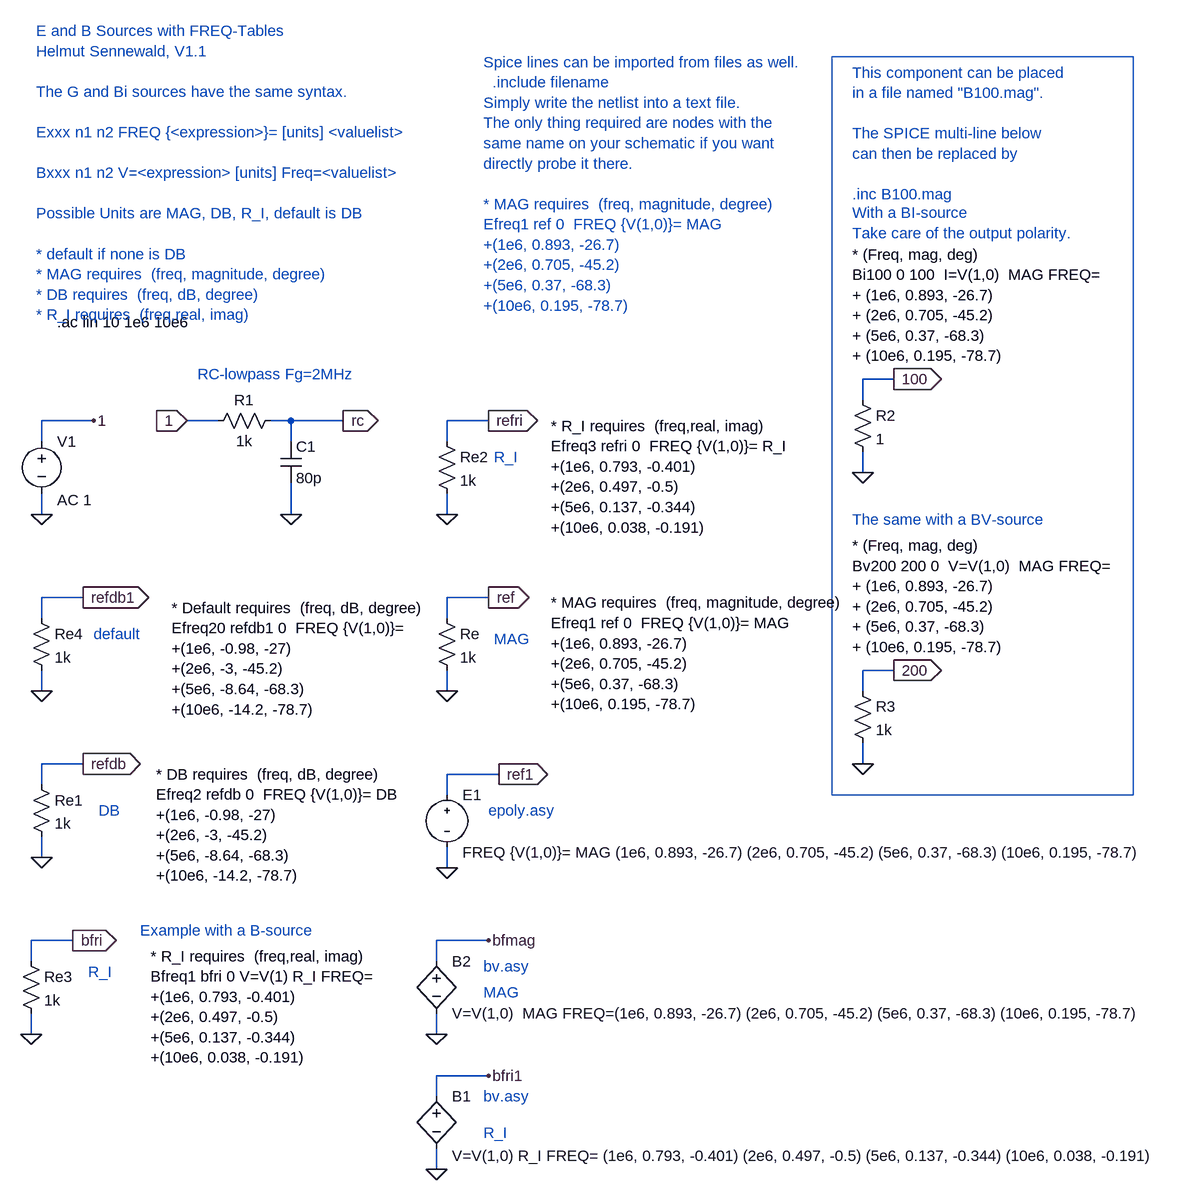
[diagram p0: schematic freq_table_E_B_1.asc]
freq_table_E_B_1.asc, the LTspice schematic file:
Version 4
SHEET 1 2784 1556
WIRE -80 800 -80 768
WIRE -80 912 -80 880
WIRE -64 0 -64 -32
WIRE -64 112 -64 80
WIRE -64 272 -64 240
WIRE -64 384 -64 352
WIRE -64 528 -64 496
WIRE -64 640 -64 608
WIRE -16 768 -80 768
WIRE 0 240 -64 240
WIRE 0 496 -64 496
WIRE 16 -32 -64 -32
WIRE 208 -32 160 -32
WIRE 320 -32 288 -32
WIRE 320 0 320 -32
WIRE 320 112 320 64
WIRE 400 -32 320 -32
WIRE 544 800 544 768
WIRE 544 912 544 880
WIRE 544 1008 544 976
WIRE 544 1120 544 1088
WIRE 560 0 560 -32
WIRE 560 112 560 80
WIRE 560 272 560 240
WIRE 560 384 560 352
WIRE 560 544 560 512
WIRE 560 656 560 624
WIRE 624 -32 560 -32
WIRE 624 240 560 240
WIRE 624 768 544 768
WIRE 624 976 544 976
WIRE 640 512 560 512
WIRE 1200 -64 1200 -96
WIRE 1200 48 1200 16
WIRE 1200 384 1200 352
WIRE 1200 496 1200 464
WIRE 1248 -96 1200 -96
WIRE 1248 352 1200 352
FLAG -64 112 0
FLAG 16 -32 1
FLAG 560 384 0
FLAG 624 240 ref
IOPIN 624 240 Out
FLAG 160 -32 1
IOPIN 160 -32 In
FLAG 320 112 0
FLAG 400 -32 rc
IOPIN 400 -32 Out
FLAG -64 640 0
FLAG 0 496 refdb
IOPIN 0 496 Out
FLAG 560 112 0
FLAG 624 -32 refri
IOPIN 624 -32 Out
FLAG -80 912 0
FLAG -16 768 bfri
IOPIN -16 768 Out
FLAG -64 384 0
FLAG 0 240 refdb1
IOPIN 0 240 Out
FLAG 544 1120 0
FLAG 624 976 bfri1
FLAG 560 656 0
FLAG 640 512 ref1
IOPIN 640 512 Out
FLAG 544 912 0
FLAG 624 768 bfmag
FLAG 1200 48 0
FLAG 1248 -96 100
IOPIN 1248 -96 Out
FLAG 1200 496 0
FLAG 1248 352 200
IOPIN 1248 352 Out
SYMBOL voltage -64 -16 R0
WINDOW 123 24 106 Left 0
WINDOW 39 0 0 Left 0
SYMATTR Value2 AC 1
SYMATTR InstName V1
SYMATTR Value ""
SYMBOL res 544 256 R0
SYMATTR InstName Re
SYMATTR Value 1k
SYMBOL res 192 -16 R270
WINDOW 0 32 56 VTop 0
WINDOW 3 0 56 VBottom 0
SYMATTR InstName R1
SYMATTR Value 1k
SYMBOL cap 304 0 R0
SYMATTR InstName C1
SYMATTR Value 80p
SYMBOL res -80 512 R0
SYMATTR InstName Re1
SYMATTR Value 1k
SYMBOL res 544 -16 R0
SYMATTR InstName Re2
SYMATTR Value 1k
SYMBOL res -96 784 R0
SYMATTR InstName Re3
SYMATTR Value 1k
SYMBOL res -80 256 R0
SYMATTR InstName Re4
SYMATTR Value 1k
SYMBOL bv 544 992 R0
WINDOW 3 24 107 Left 0
SYMATTR InstName B1
SYMATTR Value V=V(1,0) R_I FREQ= (1e6, 0.793, -0.401) (2e6, 0.497, -0.5) (5e6, 0.137, -0.344) (10e6, 0.038, -0.191)
SYMBOL Misc\\Epoly 560 528 R0
SYMATTR InstName E1
SYMATTR Value FREQ {V(1,0)}= MAG (1e6, 0.893, -26.7) (2e6, 0.705, -45.2) (5e6, 0.37, -68.3) (10e6, 0.195, -78.7)
SYMBOL bv 544 784 R0
SYMATTR InstName B2
SYMATTR Value V=V(1,0)  MAG FREQ=(1e6, 0.893, -26.7) (2e6, 0.705, -45.2) (5e6, 0.37, -68.3) (10e6, 0.195, -78.7)
SYMBOL res 1184 -80 R0
SYMATTR InstName R2
SYMATTR Value 1
SYMBOL res 1184 368 R0
SYMATTR InstName R3
SYMATTR Value 1k
TEXT 720 248 Left 0 !* MAG requires  (freq, magnitude, degree)\nEfreq1 ref 0  FREQ {V(1,0)}= MAG\n+(1e6, 0.893, -26.7)\n+(2e6, 0.705, -45.2)  \n+(5e6, 0.37, -68.3)\n+(10e6, 0.195, -78.7)
TEXT -40 -184 Left 0 !.ac lin 10 1e6 10e6
TEXT 616 -584 Left 0 ;Spice lines can be imported from files as well.\n  .include filename\nSimply write the netlist into a text file.\nThe only thing required are nodes with the\nsame name on your schematic if you want\ndirectly probe it there.\n \n* MAG requires  (freq, magnitude, degree)\nEfreq1 ref 0  FREQ {V(1,0)}= MAG\n+(1e6, 0.893, -26.7)\n+(2e6, 0.705, -45.2)  \n+(5e6, 0.37, -68.3)\n+(10e6, 0.195, -78.7)
TEXT 112 512 Left 0 !* DB requires  (freq, dB, degree)\nEfreq2 refdb 0  FREQ {V(1,0)}= DB\n+(1e6, -0.98, -27)\n+(2e6, -3, -45.2)  \n+(5e6, -8.64, -68.3)\n+(10e6, -14.2, -78.7)
TEXT -72 -632 Left 0 ;E and B Sources with FREQ-Tables\nHelmut Sennewald, V1.1\n \nThe G and Bi sources have the same syntax.\n \nExxx n1 n2 FREQ {<expression>}= [units] <valuelist> \n \nBxxx n1 n2 V=<expression> [units] Freq=<valuelist>\n \nPossible Units are MAG, DB, R_I, default is DB\n \n* default if none is DB \n* MAG requires  (freq, magnitude, degree)\n* DB requires  (freq, dB, degree)\n* R_I requires  (freq,real, imag)
TEXT 720 -24 Left 0 !* R_I requires  (freq,real, imag)\nEfreq3 refri 0  FREQ {V(1,0)}= R_I\n+(1e6, 0.793, -0.401)\n+(2e6, 0.497, -0.5)  \n+(5e6, 0.137, -0.344)\n+(10e6, 0.038, -0.191)
TEXT 104 792 Left 0 !* R_I requires  (freq,real, imag)\nBfreq1 bfri 0 V=V(1) R_I FREQ=\n+(1e6, 0.793, -0.401)\n+(2e6, 0.497, -0.5)  \n+(5e6, 0.137, -0.344)\n+(10e6, 0.038, -0.191)
TEXT 136 256 Left 0 !* Default requires  (freq, dB, degree)\nEfreq20 refdb1 0  FREQ {V(1,0)}=  \n+(1e6, -0.98, -27)\n+(2e6, -3, -45.2)  \n+(5e6, -8.64, -68.3)\n+(10e6, -14.2, -78.7)
TEXT 88 752 Left 0 ;Example with a B-source
TEXT 632 304 Left 0 ;MAG
TEXT 632 24 Left 0 ;R_I
TEXT 24 568 Left 0 ;DB
TEXT 16 296 Left 0 ;default
TEXT 8 816 Left 0 ;R_I
TEXT 624 568 Left 0 ;epoly.asy
TEXT 616 1008 Left 0 ;bv.asy
TEXT 176 -104 Left 0 ;RC-lowpass Fg=2MHz
TEXT 616 808 Left 0 ;bv.asy
TEXT 1184 -288 Left 0 !* (Freq, mag, deg)\nBi100 0 100  I=V(1,0)  MAG FREQ=\n+ (1e6, 0.893, -26.7)\n+ (2e6, 0.705, -45.2)\n+ (5e6, 0.37, -68.3)\n+ (10e6, 0.195, -78.7)
TEXT 616 848 Left 0 ;MAG
TEXT 616 1064 Left 0 ;R_I
TEXT 1184 -568 Left 0 ;This component can be placed\nin a file named "B100.mag".\n \nThe SPICE multi-line below \ncan then be replaced by\n \n.inc B100.mag
TEXT 1184 160 Left 0 !* (Freq, mag, deg)\nBv200 200 0  V=V(1,0)  MAG FREQ=\n+ (1e6, 0.893, -26.7)\n+ (2e6, 0.705, -45.2)\n+ (5e6, 0.37, -68.3)\n+ (10e6, 0.195, -78.7)
TEXT 1184 120 Left 0 ;The same with a BV-source
TEXT 1184 -352 Left 0 ;With a BI-source\nTake care of the output polarity.
RECTANGLE Normal 1616 544 1152 -592

The netlist it stands for:
* freq_table_E_B_1.asc
V1 1 0 AC 1
Re ref 0 1k
R1 1 rc 1k
C1 rc 0 80p
Re1 refdb 0 1k
Re2 refri 0 1k
Re3 bfri 0 1k
Re4 refdb1 0 1k
B1 bfri1 0 V=V(1,0) R_I FREQ= (1e6, 0.793, -0.401) (2e6, 0.497, -0.5) (5e6, 0.137, -0.344) (10e6, 0.038, -0.191)
E1 ref1 0 FREQ {V(1,0)}= MAG (1e6, 0.893, -26.7) (2e6, 0.705, -45.2) (5e6, 0.37, -68.3) (10e6, 0.195, -78.7)
B2 bfmag 0 V=V(1,0)  MAG FREQ=(1e6, 0.893, -26.7) (2e6, 0.705, -45.2) (5e6, 0.37, -68.3) (10e6, 0.195, -78.7)
R2 100 0 1
R3 200 0 1k
* MAG requires  (freq, magnitude, degree)
Efreq1 ref 0  FREQ {V(1,0)}= MAG
+(1e6, 0.893, -26.7)
+(2e6, 0.705, -45.2)
+(5e6, 0.37, -68.3)
+(10e6, 0.195, -78.7)
.ac lin 10 1e6 10e6
* Spice lines can be imported from files as well.
*   .include filename
* Simply write the netlist into a text file.
* The only thing required are nodes with the
* same name on your schematic if you want
* directly probe it there.
* * MAG requires  (freq, magnitude, degree)
* Efreq1 ref 0  FREQ {V(1,0)}= MAG
* +(1e6, 0.893, -26.7)
* +(2e6, 0.705, -45.2)
* +(5e6, 0.37, -68.3)
* +(10e6, 0.195, -78.7)
* DB requires  (freq, dB, degree)
Efreq2 refdb 0  FREQ {V(1,0)}= DB
+(1e6, -0.98, -27)
+(2e6, -3, -45.2)
+(5e6, -8.64, -68.3)
+(10e6, -14.2, -78.7)
* E and B Sources with FREQ-Tables
* Helmut Sennewald, V1.1
* The G and Bi sources have the same syntax.
* Exxx n1 n2 FREQ {<expression>}= [units] <valuelist>
* Bxxx n1 n2 V=<expression> [units] Freq=<valuelist>
* Possible Units are MAG, DB, R_I, default is DB
* * default if none is DB
* * MAG requires  (freq, magnitude, degree)
* * DB requires  (freq, dB, degree)
* * R_I requires  (freq,real, imag)
* R_I requires  (freq,real, imag)
Efreq3 refri 0  FREQ {V(1,0)}= R_I
+(1e6, 0.793, -0.401)
+(2e6, 0.497, -0.5)
+(5e6, 0.137, -0.344)
+(10e6, 0.038, -0.191)
* R_I requires  (freq,real, imag)
Bfreq1 bfri 0 V=V(1) R_I FREQ=
+(1e6, 0.793, -0.401)
+(2e6, 0.497, -0.5)
+(5e6, 0.137, -0.344)
+(10e6, 0.038, -0.191)
* Default requires  (freq, dB, degree)
Efreq20 refdb1 0  FREQ {V(1,0)}=
+(1e6, -0.98, -27)
+(2e6, -3, -45.2)
+(5e6, -8.64, -68.3)
+(10e6, -14.2, -78.7)
* Example with a B-source
* MAG
* R_I
* DB
* default
* R_I
* epoly.asy
* bv.asy
* RC-lowpass Fg=2MHz
* bv.asy
* (Freq, mag, deg)
Bi100 0 100  I=V(1,0)  MAG FREQ=
+ (1e6, 0.893, -26.7)
+ (2e6, 0.705, -45.2)
+ (5e6, 0.37, -68.3)
+ (10e6, 0.195, -78.7)
* MAG
* R_I
* This component can be placed
* in a file named "B100.mag".
* The SPICE multi-line below
* can then be replaced by
* .inc B100.mag
* (Freq, mag, deg)
Bv200 200 0  V=V(1,0)  MAG FREQ=
+ (1e6, 0.893, -26.7)
+ (2e6, 0.705, -45.2)
+ (5e6, 0.37, -68.3)
+ (10e6, 0.195, -78.7)
* The same with a BV-source
* With a BI-source
* Take care of the output polarity.
.backanno
.end